# EAGLE schematic MUTE-basic (EAGLE 9.6.0)
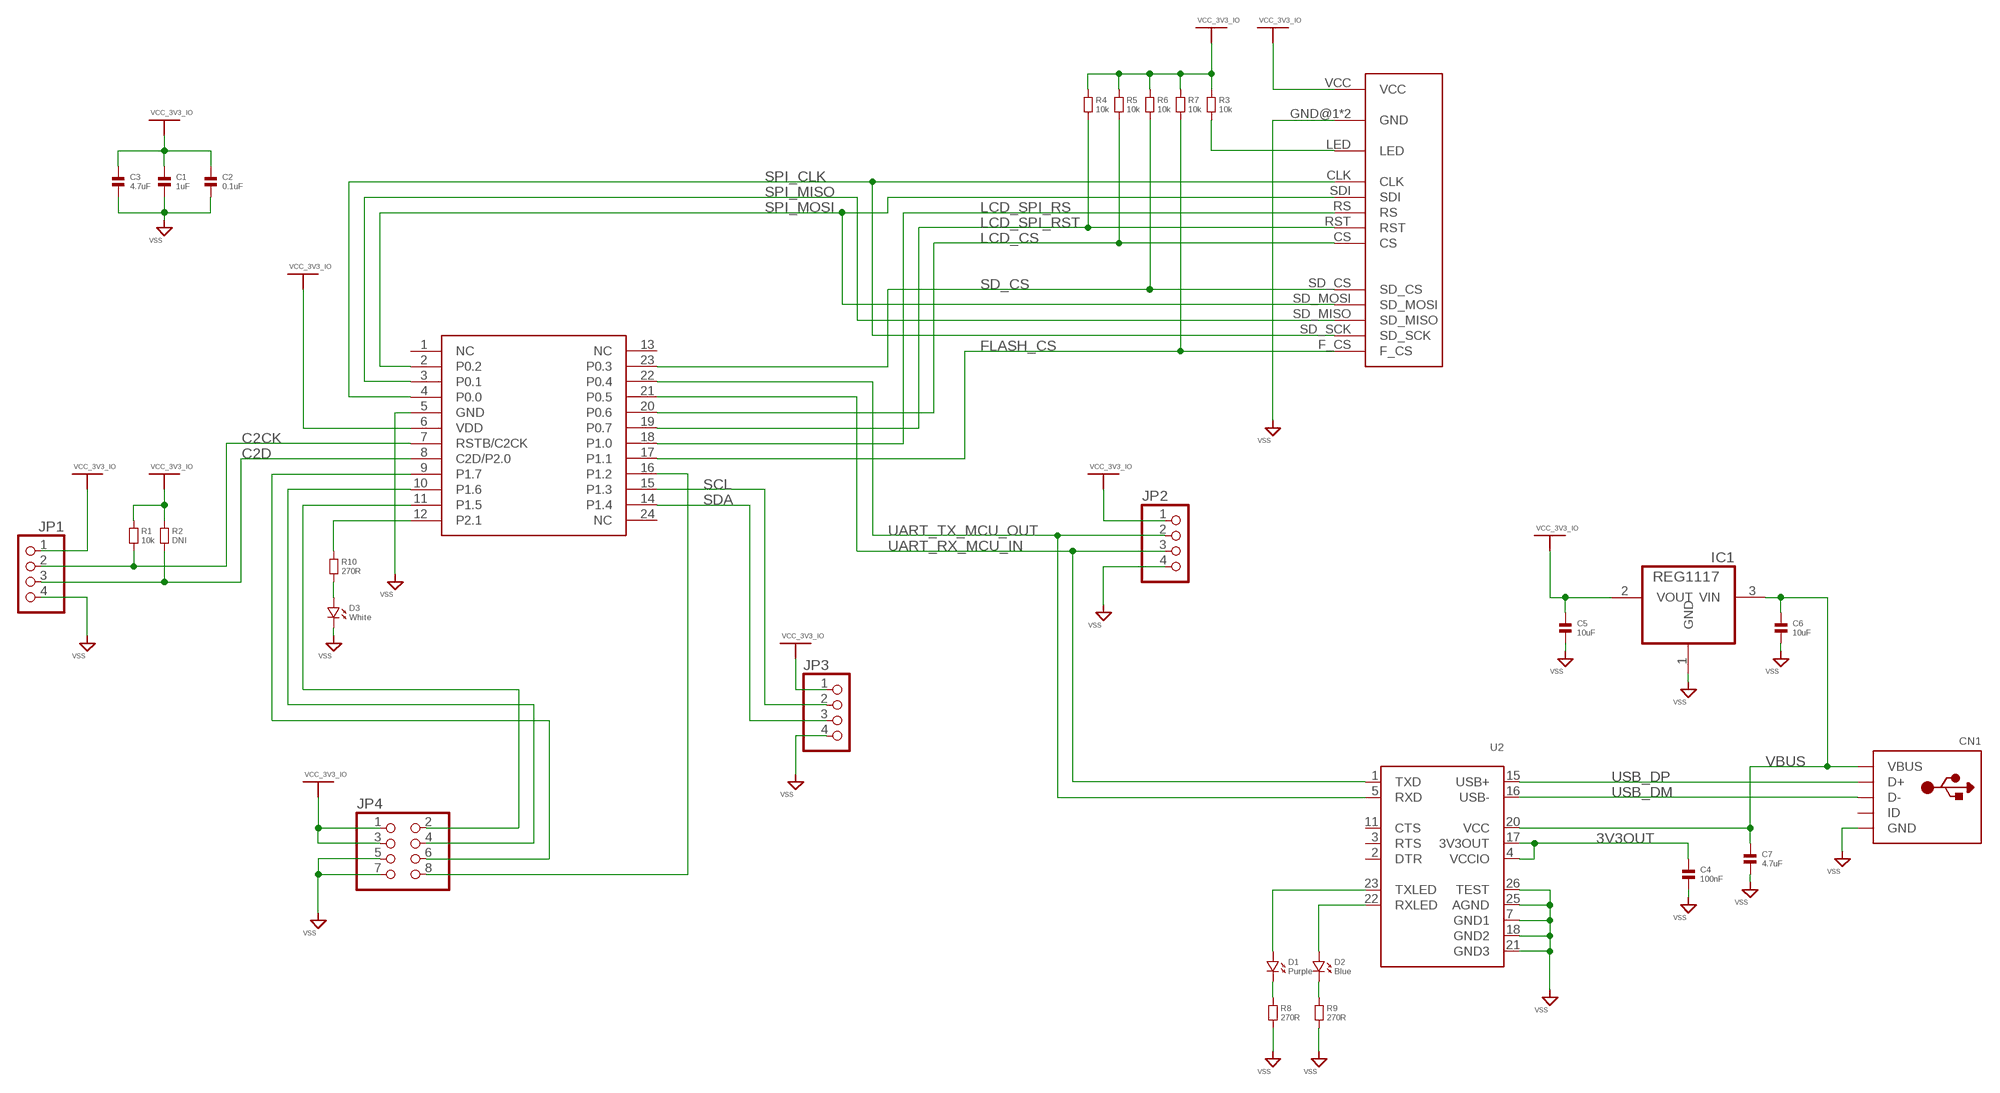
[diagram p0: schematic, sheet 1]

## Parts
C1  1uF  CAPACITOR.0603  [0603]
C2  0.1uF  CAPACITOR.0603  [0603]
C3  4.7uF  CAPACITOR.0603  [0603]
C4  100nF  CAPACITOR.0603  [0603]
C5  10uF  CAPACITOR.0603  [0603]
C6  10uF  CAPACITOR.0603  [0603]
C7  4.7uF  CAPACITOR.0603  [0603]
CN1  USBMINIB  [USB-MINIB]
D1  Purple  LED.0603  [0603.LED]
D2  Blue  LED.0603  [0603.LED]
D3  White  LED.0603  [0603.LED]
IC1  REG1117  [SOT223]
JP1  PINHD-1X4  [1X04]
JP2  PINHD-1X4  [1X04]
JP3  PINHD-1X4  [1X04]
JP4  PINHD-2X4  [2X04]
R1  10k  RESISTOR.0603  [0603]
R2  DNI  RESISTOR.0603  [0603]
R3  10k  RESISTOR.0603  [0603]
R4  10k  RESISTOR.0603  [0603]
R5  10k  RESISTOR.0603  [0603]
R6  10k  RESISTOR.0603  [0603]
R7  10k  RESISTOR.0603  [0603]
R8  270R  RESISTOR.0603  [0603]
R9  270R  RESISTOR.0603  [0603]
R10  270R  RESISTOR.0603  [0603]
U1  SILICON_LABS-MICROCONTROLLER-EFM8BB1X  [SILICON_LABS-MICROCONTROLLER-EFM8BB10F8G-A-QSOP24R]
U2  FT232RLSSOP28  [SSOP28DB]
U$1  WINGONEER_ILI9225  [WINGONEER_ILI9225]

## Nets
3V3OUT: C4.1 U2.4(VCCIO) U2.17(3V3OUT)
C2CK: JP1.2 R1.2 U1.7(RSTB/C2CK)
C2D: JP1.3 R2.2 U1.8(C2D/P2.0)
FLASH_CS: R7.2 U1.17(P1.1) U$1.F_CS
LCD_CS: R5.2 U1.20(P0.6) U$1.CS
LCD_SPI_RS: U1.18(P1.0) U$1.RS
LCD_SPI_RST: R4.2 U1.19(P0.7) U$1.RST
N$1: D3.P$1 R10.2
N$2: R3.2 U$1.LED
N$3: JP4.8 U1.16(P1.2)
N$5: JP4.6 U1.9(P1.7)
N$6: D1.P$1 U2.23(TXLED)
N$7: D2.P$1 U2.22(RXLED)
N$8: D2.P$2 R9.1
N$9: D1.P$2 R8.1
N$10: JP4.2 U1.11(P1.5)
N$12: JP4.4 U1.10(P1.6)
SCL: JP3.2 U1.15(P1.3)
SD_CS: R6.2 U1.23(P0.3) U$1.SD_CS
SDA: JP3.3 U1.14(P1.4)
SPI_CLK: U1.4(P0.0) U$1.CLK U$1.SD_SCK
SPI_MISO: U1.3(P0.1) U$1.SD_MISO
SPI_MOSI: U1.2(P0.2) U$1.SD_MOSI U$1.SDI
TEST_LED: R10.1 U1.12(P2.1)
UART_RX_MCU_IN: JP2.3 U1.21(P0.5) U2.1(TXD)
UART_TX_MCU_OUT: JP2.2 U1.22(P0.4) U2.5(RXD)
USB_DM: CN1.D- U2.16(USB-)
USB_DP: CN1.D+ U2.15(USB+)
VBUS: C6.1 C7.1 CN1.VBUS IC1.3(VIN) U2.20(VCC)
VCC_3V3_IO: C1.1 C2.1 C3.1 C5.1 IC1.2(VOUT) JP1.1 JP2.1 JP3.1 JP4.1 JP4.3 R1.1 R2.1 R3.1 R4.1 R5.1 R6.1 R7.1 U1.6(VDD) U$1.VCC
VSS: C1.2 C2.2 C3.2 C4.2 C5.2 C6.2 C7.2 CN1.GND D3.P$2 IC1.1(GND) JP1.4 JP2.4 JP3.4 JP4.5 JP4.7 R8.2 R9.2 U1.5(GND) U2.7(GND1) U2.18(GND2) U2.21(GND3) U2.25(AGND) U2.26(TEST) U$1.GND@1(GND) U$1.GND@2(GND)
Unconnected: CN1.ID U1.1(NC) U1.13(NC) U1.24(NC) U2.2(DTR) U2.3(RTS) U2.11(CTS)

## Library data of the parts
C1-C7 = standardparts:CAPACITOR
CN1 = adafruit:USB: USB Connectors USBMINIB - Surface Mount Female Mini-B USB Connector 4UConnector: 06564 By microbuilder.eu Thru-hole RA Female Mini-B USB Connector 4UConnector: 18732 By ladyada.net
D1-D3 = standardparts:LED
IC1 = burr-brown:REG1117: 800mA and 1A Low Dropout (LDO) Positive Regulator 1.8V, 2.5V, 2.85V, 3.3V, 5V, and Adj; MPN: REG1117; OC_FARNELL: 1097566; OC_NEWARK: 14P6981
JP1-JP3 = pinhead:PINHD-1X4: PIN HEADER
JP4 = pinhead:PINHD-2X4: PIN HEADER
R1-R10 = standardparts:RESISTOR
U1 = Module_ICs:SILICON_LABS-MICROCONTROLLER-EFM8BB1X
U2 = microbuilder:FT232RL: FTDI FT232RL USB TO RS232 Converter Digikey: 768-1007-1-ND
U$1 = PocketPC_Screens:WINGONEER_ILI9225